# EAGLE schematic RTMS Voltage Regulation Circuit (EAGLE 9.2.0)
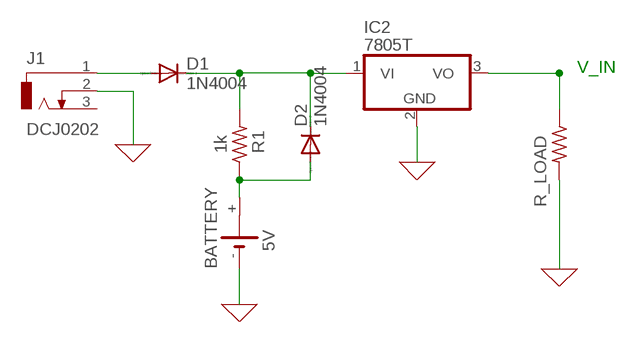
[diagram p0: schematic, sheet 1]

## Parts
BATTERY  5V  CR-AA  [CRAA]
D1  1N4004  [DO41-10]
D2  1N4004  [DO41-10]
IC2  7805T  [TO220H]
J1  DCJ0202  [DCJ0202]
R1  1k  R-US_0207/10  [0207/10]
R_LOAD  R-US_0207/10  [0207/10]

## Nets
0: BATTERY.- IC2.2(GND) J1.2 R_LOAD.2 ; supply symbol labelled GND
N$1: BATTERY.+ D2.A R1.1
N$2: D1.C D2.C IC2.1(VI) R1.2
N$3: IC2.3(VO) R_LOAD.1
N$4: D1.A J1.1
Unconnected: BATTERY.+@1(+) J1.3

## Notes on the sheet
- V_IN

## Library data of the parts
BATTERY = battery:CR-AA: LI BATTERY Varta CRAA-SLF; BATTERY: 5 V
D1 D2 = diode:1N4004: DIODE general purpose rectifier, 1 A
IC2 = linear:78*: Positive VOLTAGE REGULATOR Source: http://cache.national.com/ds/LM/LM78L05.pdf http://www.fairchildsemi.com/ds/LM/LM7805.pdf
J1 = con-jack:DCJ0202: DC POWER JACK Source: DCJ0202.pdf; OC_FARNELL: unknown; OC_NEWARK: unknown
R1 = rcl:R-US_: RESISTOR, American symbol; SPICEPREFIX: 1000 Ohm
R_LOAD = rcl:R-US_: RESISTOR, American symbol; SPICEPREFIX: R_Load